# Altium project WiirdFlex Top.PrjPcb
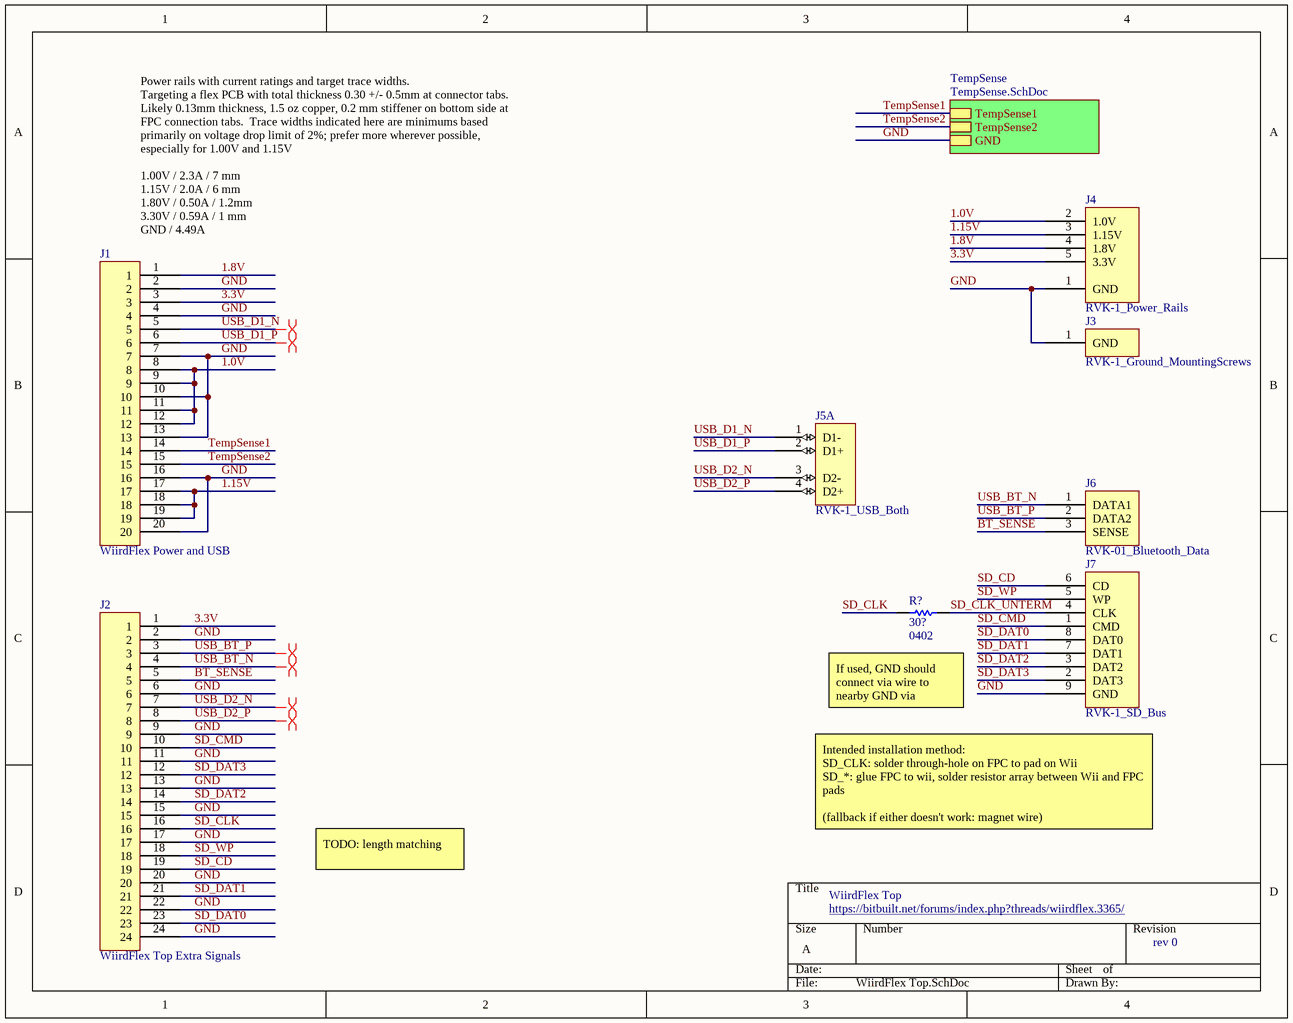
[diagram p0: WiirdFlex Top.SchDoc]
2 sheets, 12 parts. Net scope: hierarchical (ports join the sheet entries above them; power ports are global).
Board file: WiirdFlex Top.PcbDoc
Sheets:
  WiirdFlex Top.SchDoc
    TempSense = TempSense.SchDoc

## Sheet WiirdFlex Top.SchDoc
size A

### Parts
J1  WiirdFlex Power and USB  [2-1734248-0 FPC tab]
J2  WiirdFlex Top Extra Signals  [FH12A-24S-0.5SH(55) FPC TAB]
J3  RVK-1_Ground_MountingScrews  [RVK-1_GND_Screws - LMAO with extra screwpost]
J4  RVK-1_Power_Rails  [RVK-1_Power_Rails_Top_Direct]
J5A  RVK-1_USB_Both  [RVK-1_USB_Top]
J6  RVK-01_Bluetooth_Data  [RVK-1_BT_Data]
J7  RVK-1_SD_Bus  [RVK-1_SD_RPADS_TOP_FLEX]
R?  value 30?  Package: 0402  [RESC1005X04N]  (hidden comment: Resistor)

### Sub-sheets
TempSense = TempSense.SchDoc: TempSense1, TempSense2, GND

### Nets
GND: J1.2 J1.4 J1.7 J1.10 J1.13 J1.16 J1.20 J2.2 J2.6 J2.9 J2.11 J2.13 J2.15 J2.17 J2.20 J2.22 J2.24 J3.1(GND) J4.1(GND) J7.9(GND) ; sheet TempSense/GND
1.0V: J1.8 J1.9 J1.11 J1.12 J4.2(1.0V)
1.8V: J1.1 J4.4(1.8V)
1.15V: J1.17 J1.18 J1.19 J4.3(1.15V)
3.3V: J1.3 J2.1 J4.5(3.3V)
BT_SENSE: J2.5 J6.3(SENSE)
SD_CD: J2.19 J7.6(CD)
SD_CLK: J2.16 R?.1
SD_CLK_UNTERM: J7.4(CLK) R?.2
SD_CMD: J2.10 J7.1(CMD)
SD_DAT0: J2.23 J7.8(DAT0)
SD_DAT1: J2.21 J7.7(DAT1)
SD_DAT2: J2.14 J7.3(DAT2)
SD_DAT3: J2.12 J7.2(DAT3)
SD_WP: J2.18 J7.5(WP)
TempSense1: J1.14 ; sheet TempSense/TempSense1
TempSense2: J1.15 ; sheet TempSense/TempSense2
USB_BT_N: J2.4 J6.1(DATA1)
USB_BT_P: J2.3 J6.2(DATA2)
USB_D1_N: J1.5 J5A.1(D1-)
USB_D1_P: J1.6 J5A.2(D1+)
USB_D2_N: J2.7 J5A.3(D2-)
USB_D2_P: J2.8 J5A.4(D2+)

### Layout directives
differential pair; differential pair class USB: USB_BT_N, USB_BT_P, USB_D1_N, USB_D1_P, USB_D2_N, USB_D2_P

### Notes on the sheet
- (near J1) Power rails with current ratings and target trace widths.
  Targeting a flex PCB with total thickness 0.30 +/- 0.5mm at connector tabs.  Likely 0.13mm thickness, 1.5 oz copper, 0.2 mm stiffener on bottom side at FPC connection tabs.  Trace widths indicated here are minimums based primarily on voltage drop limit of 2%; prefer more wherever possible, especially for 1.00V and 1.15V
  1.00V / 2.3A / 7 mm
  1.15V / 2.0A / 6 mm
  1.80V / 0.50A / 1.2mm
  3.30V / 0.59A / 1 mm
  GND / 4.49A
- (near R?) If used, GND should connect via wire to nearby GND via
- (near J7) Intended installation method:
  SD_CLK: solder through-hole on FPC to pad on Wii
  SD_*: glue FPC to wii, solder resistor array between Wii and FPC pads
  (fallback if either doesn't work: magnet wire)
- TODO: length matching
- WiirdFlex Top
- https://bitbuilt.net/forums/index.php?threads/wiirdflex.3365/
- rev 0

### Library data of the parts
J1 = WiirdFlex Power and USB: FPC tab connector for power, main USB, and thermistor/temp sensor
J2 = WiirdFlex Top Extra Signals: FPC tab connector for extra signals: USB, BT, SD
J4 = RVK-1_Power_Rails: Connection points for Wii power rails
R? = Resistor: General purpose resistor

## Sheet TempSense.SchDoc
size A
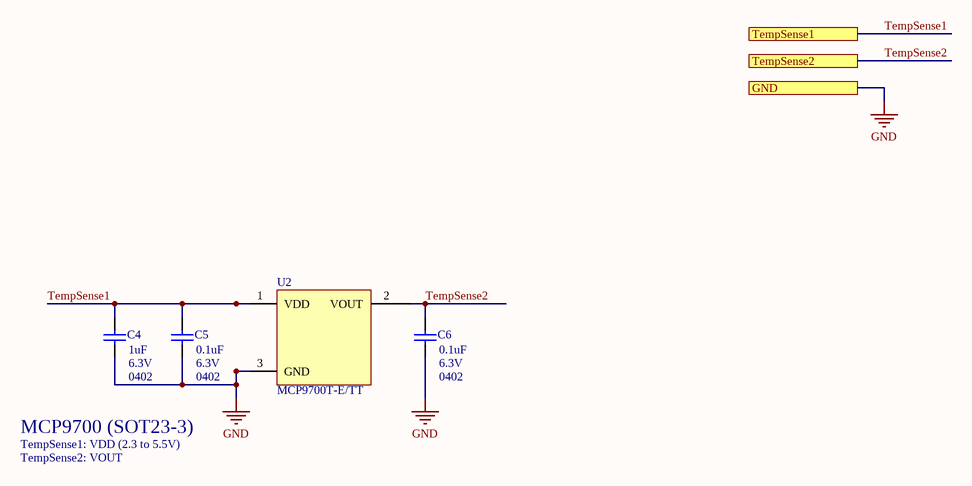
[diagram p1: TempSense.SchDoc]

### Parts
C4  value 1uF  Rated Voltage: 6.3V  Package: 0402  [CAPC1005X06N]  (hidden comment: Capacitor)
C5  value 0.1uF  Rated Voltage: 6.3V  Package: 0402  [CAPC1005X06N]  (hidden comment: Capacitor)
C6  value 0.1uF  Rated Voltage: 6.3V  Package: 0402  [CAPC1005X06N]  (hidden comment: Capacitor)
U2  MCP9700T-E/TT  [SOT95P237X112-3N]

### Ports
GND, TempSense1, TempSense2

### Nets
GND: C4.1 C5.1 C6.1 U2.3(GND) ; port GND
TempSense1: C4.2 C5.2 U2.1(VDD) ; port TempSense1
TempSense2: C6.2 U2.2(VOUT) ; port TempSense2

### Notes on the sheet
- MCP9700 (SOT23-3)
- TempSense1: VDD (2.3 to 5.5V)
- TempSense2: VOUT

### Library data of the parts
C4-C6 = Capacitor: General purpose capacitor
U2 = MCP9700T-E/TT: Low-Power Linear Active Thermistor IC, SOT-23-3 package

## Nets that join several sheets
GND: WiirdFlex Top (20 pins), TempSense (C4.1 C5.1 C6.1 U2.3)
TempSense1: WiirdFlex Top (J1.14), TempSense (C4.2 C5.2 U2.1)
TempSense2: WiirdFlex Top (J1.15), TempSense (C6.2 U2.2)